# EAGLE design intex_spa_V4 (EAGLE 8.3.2)
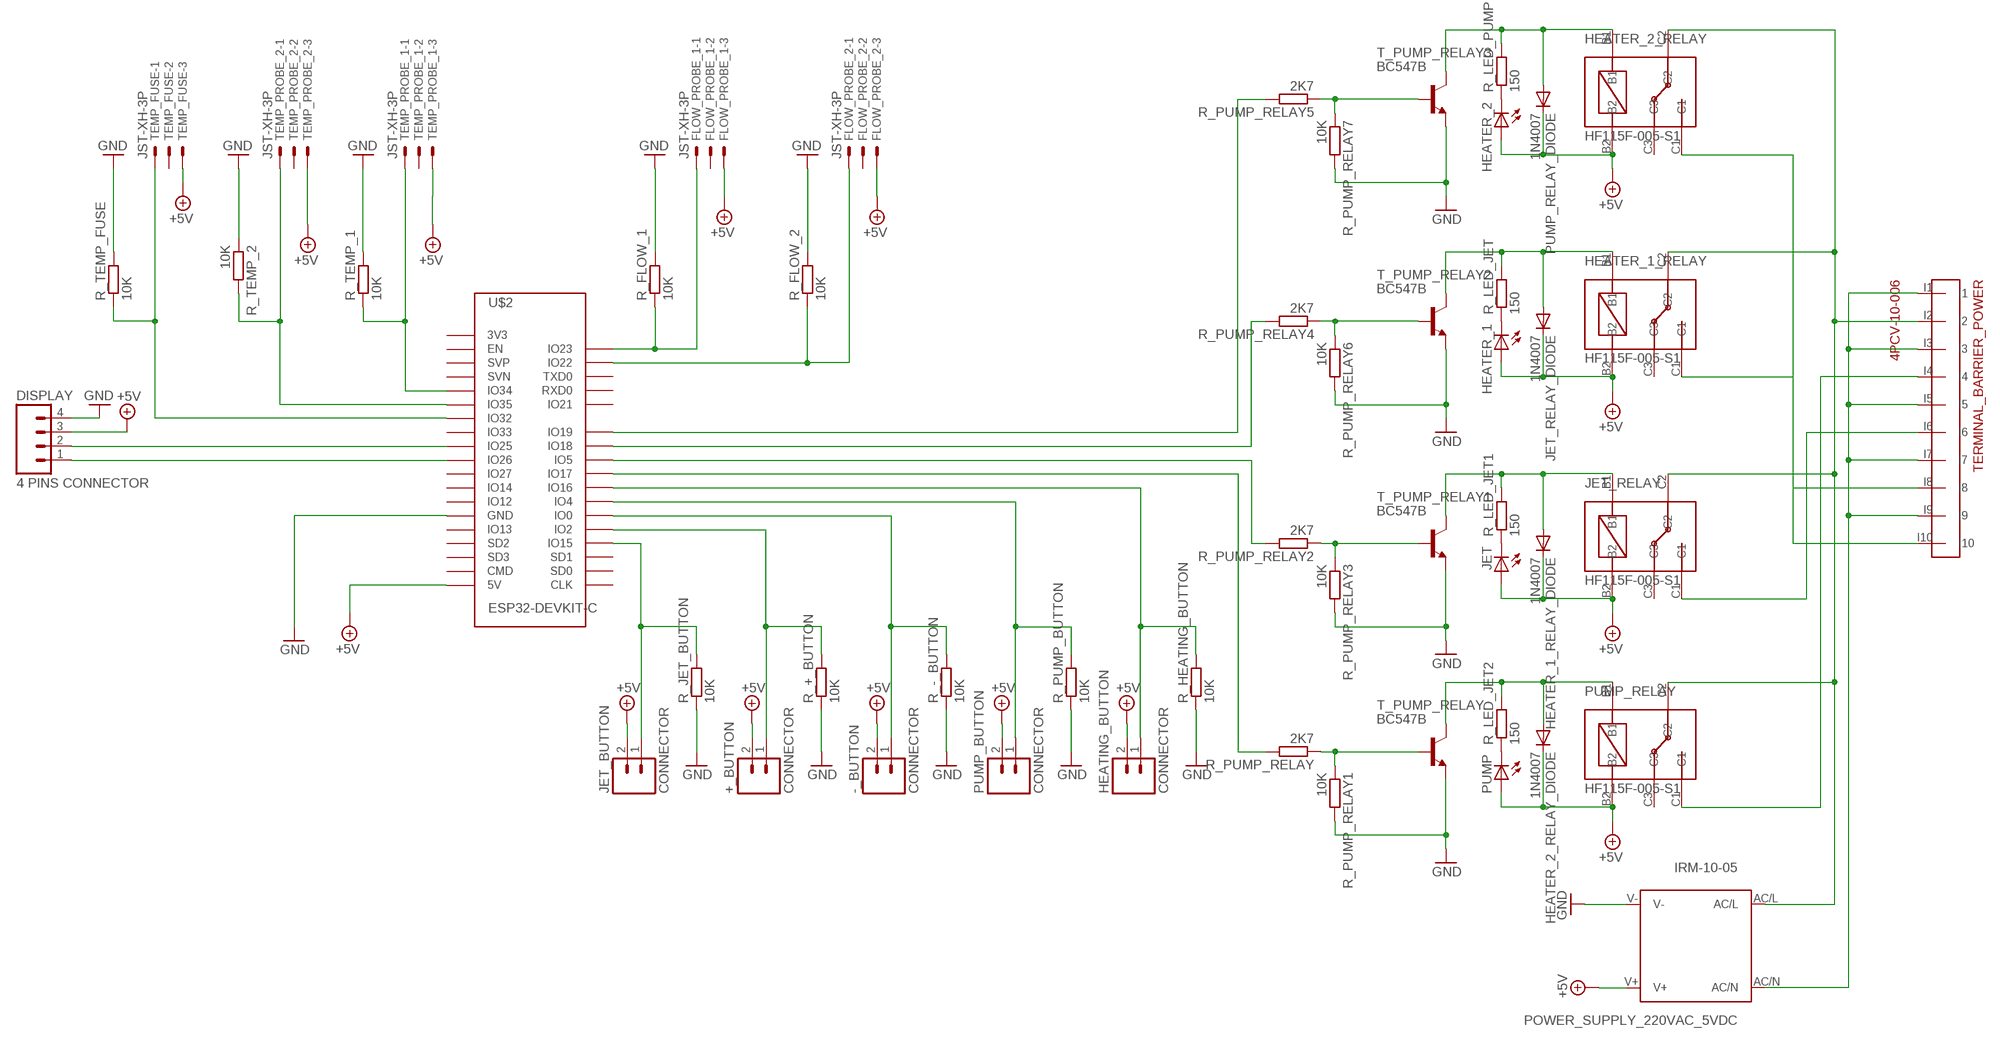
[diagram p0: schematic, sheet 1]

## Parts
+_BUTTON  CONNECTOR  M02JST-PTH-VERT  [JST-2-PTH-VERT]
-_BUTTON  CONNECTOR  M02JST-PTH-VERT  [JST-2-PTH-VERT]
DISPLAY  4 PINS CONNECTOR  M04PTH  [1X04]
FLOW_PROBE_1  JST-XH-3P  JST-XH-03-PIN-LONG-PAD  [JST-XH-03-PACKAGE-LONG-PAD]
FLOW_PROBE_2  JST-XH-3P  JST-XH-03-PIN-LONG-PAD  [JST-XH-03-PACKAGE-LONG-PAD]
HEATER_1  LED3MM  [LED3MM]
HEATER_1_RELAY  HF115F-005-S1  [HF115F-005-S1]
HEATER_1_RELAY_DIODE  1N4007  1N4004  [DO41-10]
HEATER_2  LED3MM  [LED3MM]
HEATER_2_RELAY  HF115F-005-S1  [HF115F-005-S1]
HEATER_2_RELAY_DIODE  1N4007  1N4004  [DO41-10]
HEATING_BUTTON  CONNECTOR  M02JST-PTH-VERT  [JST-2-PTH-VERT]
JET  LED3MM  [LED3MM]
JET_BUTTON  CONNECTOR  M02JST-PTH-VERT  [JST-2-PTH-VERT]
JET_RELAY  HF115F-005-S1  [HF115F-005-S1]
JET_RELAY_DIODE  1N4007  1N4004  [DO41-10]
POWER_SUPPLY_220VAC_5VDC  IRM-10-05  IRM_05/10IRM_05/10  [IRM_05/10]
PUMP  LED3MM  [LED3MM]
PUMP_BUTTON  CONNECTOR  M02JST-PTH-VERT  [JST-2-PTH-VERT]
PUMP_RELAY  HF115F-005-S1  [HF115F-005-S1]
PUMP_RELAY_DIODE  1N4007  1N4004  [DO41-10]
R_+_BUTTON  10K  R-EU_0204/5  [0204/5]
R_-_BUTTON  10K  R-EU_0204/5  [0204/5]
R_FLOW_1  10K  R-EU_0207/10  [0207/10]
R_FLOW_2  10K  R-EU_0207/10  [0207/10]
R_HEATING_BUTTON  10K  R-EU_0204/5  [0204/5]
R_JET_BUTTON  10K  R-EU_0204/5  [0204/5]
R_LED_JET  150  R-EU_0204/5  [0204/5]
R_LED_JET1  150  R-EU_0204/5  [0204/5]
R_LED_JET2  150  R-EU_0204/5  [0204/5]
R_LED_PUMP  150  R-EU_0204/5  [0204/5]
R_PUMP_BUTTON  10K  R-EU_0204/5  [0204/5]
R_PUMP_RELAY  2K7  R-EU_0204/5  [0204/5]
R_PUMP_RELAY1  10K  R-EU_0204/5  [0204/5]
R_PUMP_RELAY2  2K7  R-EU_0204/5  [0204/5]
R_PUMP_RELAY3  10K  R-EU_0204/5  [0204/5]
R_PUMP_RELAY4  2K7  R-EU_0204/5  [0204/5]
R_PUMP_RELAY5  2K7  R-EU_0204/5  [0204/5]
R_PUMP_RELAY6  10K  R-EU_0204/5  [0204/5]
R_PUMP_RELAY7  10K  R-EU_0204/5  [0204/5]
R_TEMP_1  10K  R-EU_0207/10  [0207/10]
R_TEMP_2  10K  R-EU_0207/10  [0207/10]
R_TEMP_FUSE  10K  R-EU_0207/10  [0207/10]
T_PUMP_RELAY  BC547B  [TO92]
T_PUMP_RELAY1  BC547B  [TO92]
T_PUMP_RELAY2  BC547B  [TO92]
T_PUMP_RELAY3  BC547B  [TO92]
TEMP_FUSE  JST-XH-3P  JST-XH-03-PIN-LONG-PAD  [JST-XH-03-PACKAGE-LONG-PAD]
TEMP_PROBE_1  JST-XH-3P  JST-XH-03-PIN-LONG-PAD  [JST-XH-03-PACKAGE-LONG-PAD]
TEMP_PROBE_2  JST-XH-3P  JST-XH-03-PIN-LONG-PAD  [JST-XH-03-PACKAGE-LONG-PAD]
TERMINAL_BARRIER_POWER  4PCV-10-006  [4PCV-10-006]
U$2  ESP32-DEVKIT-C  [ESP32-DEVKIT-C]

## Nets
+5V: +_BUTTON.2 -_BUTTON.2 DISPLAY.3 FLOW_PROBE_1.3 FLOW_PROBE_2.3 HEATER_1.A HEATER_1_RELAY.B2 HEATER_1_RELAY_DIODE.C HEATER_2.A HEATER_2_RELAY.B2 HEATER_2_RELAY_DIODE.C HEATING_BUTTON.2 JET.A JET_BUTTON.2 JET_RELAY.B2 JET_RELAY_DIODE.C POWER_SUPPLY_220VAC_5VDC.V+ PUMP.A PUMP_BUTTON.2 PUMP_RELAY.B2 PUMP_RELAY_DIODE.C TEMP_FUSE.3 TEMP_PROBE_1.3 TEMP_PROBE_2.3 U$2.5V
GND: DISPLAY.4 POWER_SUPPLY_220VAC_5VDC.V- R_+_BUTTON.1 R_-_BUTTON.1 R_FLOW_1.2 R_FLOW_2.2 R_HEATING_BUTTON.1 R_JET_BUTTON.1 R_PUMP_BUTTON.1 R_PUMP_RELAY1.2 R_PUMP_RELAY3.2 R_PUMP_RELAY6.2 R_PUMP_RELAY7.2 R_TEMP_1.2 R_TEMP_2.1 R_TEMP_FUSE.2 T_PUMP_RELAY1.1(E) T_PUMP_RELAY2.1(E) T_PUMP_RELAY3.1(E) T_PUMP_RELAY.1(E) U$2.GND U$2.GND2(GND) U$2.GND3(GND)
LEAD: HEATER_1_RELAY.C2 HEATER_2_RELAY.C2 JET_RELAY.C2 POWER_SUPPLY_220VAC_5VDC.AC/L PUMP_RELAY.C2 TERMINAL_BARRIER_POWER.I2
LEAD_HEATER_1: HEATER_1_RELAY.C1 TERMINAL_BARRIER_POWER.I8
LEAD_HEATER_2: HEATER_2_RELAY.C1 TERMINAL_BARRIER_POWER.I10
LEAD_JET: JET_RELAY.C1 TERMINAL_BARRIER_POWER.I6
LEAD_PUMP: PUMP_RELAY.C1 TERMINAL_BARRIER_POWER.I4
N$1: R_PUMP_RELAY.2 U$2.IO17
N$2: R_TEMP_2.2 TEMP_PROBE_2.1 U$2.IO35
N$4: FLOW_PROBE_2.1 R_FLOW_2.1 U$2.IO22
N$5: R_PUMP_RELAY5.2 U$2.IO19
N$6: R_PUMP_RELAY4.2 U$2.IO18
N$7: R_PUMP_RELAY2.2 U$2.IO5
N$8: HEATER_2.K(C) R_LED_PUMP.1
N$9: R_TEMP_FUSE.1 TEMP_FUSE.1 U$2.IO32
N$10: FLOW_PROBE_1.1 R_FLOW_1.1 U$2.IO23
N$12: DISPLAY.1 U$2.IO26
N$13: DISPLAY.2 U$2.IO25
N$14: HEATING_BUTTON.1 R_HEATING_BUTTON.2 U$2.IO16
N$15: -_BUTTON.1 R_-_BUTTON.2 U$2.IO0
N$16: PUMP_BUTTON.1 R_PUMP_BUTTON.2 U$2.IO4
N$18: +_BUTTON.1 R_+_BUTTON.2 U$2.IO2
N$19: JET_BUTTON.1 R_JET_BUTTON.2 U$2.IO15
N$20: JET.K(C) R_LED_JET1.1
N$21: HEATER_1_RELAY_DIODE.A JET_RELAY.B1 R_LED_JET1.2 T_PUMP_RELAY1.3(C)
N$22: HEATER_1.K(C) R_LED_JET.1
N$24: PUMP.K(C) R_LED_JET2.1
N$25: HEATER_2_RELAY_DIODE.A PUMP_RELAY.B1 R_LED_JET2.2 T_PUMP_RELAY.3(C)
N$31: R_TEMP_1.1 TEMP_PROBE_1.1 U$2.IO34
N$32: R_PUMP_RELAY1.1 R_PUMP_RELAY.1 T_PUMP_RELAY.2(B)
N$33: HEATER_1_RELAY.B1 JET_RELAY_DIODE.A R_LED_JET.2 T_PUMP_RELAY2.3(C)
N$34: HEATER_2_RELAY.B1 PUMP_RELAY_DIODE.A R_LED_PUMP.2 T_PUMP_RELAY3.3(C)
N$35: R_PUMP_RELAY2.1 R_PUMP_RELAY3.1 T_PUMP_RELAY1.2(B)
N$38: R_PUMP_RELAY4.1 R_PUMP_RELAY6.1 T_PUMP_RELAY2.2(B)
N$39: R_PUMP_RELAY5.1 R_PUMP_RELAY7.1 T_PUMP_RELAY3.2(B)
NEUTRAL: POWER_SUPPLY_220VAC_5VDC.AC/N TERMINAL_BARRIER_POWER.I1 TERMINAL_BARRIER_POWER.I3 TERMINAL_BARRIER_POWER.I5 TERMINAL_BARRIER_POWER.I7 TERMINAL_BARRIER_POWER.I9
Unconnected: FLOW_PROBE_1.2 FLOW_PROBE_2.2 HEATER_1_RELAY.C3 HEATER_2_RELAY.C3 JET_RELAY.C3 PUMP_RELAY.C3 TEMP_FUSE.2 TEMP_PROBE_1.2 TEMP_PROBE_2.2 U$2.3V3 U$2.CLK U$2.CMD U$2.EN U$2.IO12 U$2.IO13 U$2.IO14 U$2.IO21 U$2.IO27 U$2.IO33 U$2.RXD0 U$2.SD0 U$2.SD1 U$2.SD2 U$2.SD3 U$2.SVN U$2.SVP U$2.TXD0

## Library data of the parts
+_BUTTON -_BUTTON HEATING_BUTTON JET_BUTTON PUMP_BUTTON = SparkFun-Connectors:M02: Standard 2-pin 0.1" header. Use with - straight break away headers ( PRT-00116) - right angle break away headers (PRT-00553) - swiss pins (PRT-00743) - machine pins (PRT-00117) - female headers (PRT-00115) Molex polarized connector foot print use with: PRT-08233 with associated crimp pins and housings. 2.54_SCREWTERM for use with PRT-10571. 3.5mm Screw Terminal footprints for PRT-08084 5mm Screw Terminal footprints for use with PRT-08432
DISPLAY = SparkFun-Connectors:M04: Header 4 Standard 4-pin 0.1" header. Use with straight break away headers (SKU : PRT-00116), right angle break away headers (PRT-00553), swiss pins (PRT-00743), machine pins (PRT-00117), and female headers (PRT-00115). Molex polarized connector foot print use with SKU : PRT-08231 with associated crimp pins and housings. 1MM SMD Version SKU: PRT-10208; PROD_ID: CONN-09696
FLOW_PROBE_1 FLOW_PROBE_2 TEMP_FUSE TEMP_PROBE_1 TEMP_PROBE_2 = Rembrandt Electronics - JST XH Connectors v1-0:JST-XH-03-PIN: JST XH Connector 2 Pin Wire to board connector. Pitch: 2,54 mm, (0.100") Number of pins: 3 Created by Rembrandt Electronics www.rembrandtelectronics.com
HEATER_1 HEATER_2 JET PUMP = led:LED: LED OSRAM: - CHIPLED LG R971, LG N971, LY N971, LG Q971, LY Q971, LO R971, LY R971 LH N974, LH R974 LS Q976, LO Q976, LY Q976 LO Q996 - Hyper CHIPLED LW Q18S LB Q993, LB Q99A, LB R99A - SideLED LS A670, LO A670, LY A670, LG A670, LP A670 LB A673, LV A673, LT A673, LW A673 LH A674 LY A675 LS A676, LA A676, LO A676, LY A676, LW A676 LS A679, LY A679, LG A679 - Hyper Micro SIDELED® LS Y876, LA Y876, LO Y876, LY Y876 LT Y87S - SmartLED LW L88C, LW L88S LB L89C, LB L89S, LG L890 LS L89K, LO L89K, LY L89K LS L896, LA L896, LO L896, LY L896 - TOPLED LS T670, LO T670, LY T670, LG T670, LP T670 LSG T670, LSP T670, LSY T670, LOP T670, LYG T670 LG T671, LOG T671, LSG T671 LB T673, LV T673, LT T673, LW T673 LH T674 LS T676, LA T676, LO T676, LY T676, LB T676, LH T676, LSB T676, LW T676 LB T67C, LV T67C, LT T67C, LS T67K, LO T67K, LY T67K, LW E67C LS E67B, LA E67B, LO E67B, LY E67B, LB E67C, LV E67C, LT E67C LW T67C LS T679, LY T679, LG T679 LS T770, LO T770, LY T770, LG T770, LP T770 LB T773, LV T773, LT T773, LW T773 LH T774 LS E675, LA E675, LY E675, LS T675 LS T776, LA T776, LO T776, LY T776, LB T776 LHGB T686 LT T68C, LB T68C - Hyper Mini TOPLED® LB M676 - Mini TOPLED Santana® LG M470 LS M47K, LO M47K, LY M47K Source: http://www.osram.convergy.de LUXEON: - LUMILED® LXK2-PW12-R00, LXK2-PW12-S00, LXK2-PW14-U00, LXK2-PW14-V00 LXK2-PM12-R00, LXK2-PM12-S00, LXK2-PM14-U00 LXK2-PE12-Q00, LXK2-PE12-R00, LXK2-PE12-S00, LXK2-PE14-T00, LXK2-PE14-U00 LXK2-PB12-K00, LXK2-PB12-L00, LXK2-PB12-M00, LXK2-PB14-N00, LXK2-PB14-P00, LXK2-PB14-Q00 LXK2-PR12-L00, LXK2-PR12-M00, LXK2-PR14-Q00, LXK2-PR14-R00 LXK2-PD12-Q00, LXK2-PD12-R00, LXK2-PD12-S00 LXK2-PH12-R00, LXK2-PH12-S00 LXK2-PL12-P00, LXK2-PL12-Q00, LXK2-PL12-R00 Source: www.luxeon.com KINGBRIGHT: KA-3528ASYC Source: www.kingbright.com
HEATER_1_RELAY HEATER_2_RELAY JET_RELAY PUMP_RELAY = HF115F-005-S1:HF115F-005-S1
HEATER_1_RELAY_DIODE HEATER_2_RELAY_DIODE JET_RELAY_DIODE PUMP_RELAY_DIODE = diode:1N4004: DIODE general purpose rectifier, 1 A
POWER_SUPPLY_220VAC_5VDC = meanwell_irm_v7:IRM_05/10: 5 or 10 watt housing & pin compatible IRM 05 Vout [V] Imax [A] Pmax [W] Eff [%] 3.3 1.25 4.125 68 5 1 5 71 12 0.42 5.04 75 15 0.33 4.95 75 24 0.23 5.52 77 IRM 10 Vout [V] Imax [A] Pmax [W] Eff [%] 3.3 2.5 8.25 74 5 2 10 77 12 0.85 10.2 82 15 0.67 10.05 82 24 0.42 10.08 82
R_+_BUTTON R_-_BUTTON R_FLOW_1 R_FLOW_2 R_HEATING_BUTTON R_JET_BUTTON R_PUMP_BUTTON R_PUMP_RELAY R_PUMP_RELAY1-R_PUMP_RELAY7 R_TEMP_1 R_TEMP_2 R_TEMP_FUSE = rcl:R-EU_: RESISTOR, European symbol
R_LED_JET R_LED_JET1 R_LED_JET2 R_LED_PUMP = resistor:R-EU_: RESISTOR, European symbol
T_PUMP_RELAY T_PUMP_RELAY1-T_PUMP_RELAY3 = transistor-npn:BC547*: NPN Transistor
TERMINAL_BARRIER_POWER = 4PCV-10-006:4PCV-10-006
U$2 = ESP32:ESP32-DEVKIT-C: Espressif ESP32 DEVKIT C MODULE.

## Net classes
0 default: width 0.152 mm, drill 0.508 mm, clearance 0.1 mm
1 220V: width 2.362 mm, drill 0.508 mm, clearance 1.25 mm to class 0, clearance 1.25 mm

## Board
Intex Arduino Spa Manager MK 0 - Designed by Richard Perez richard@perez-mail.fr
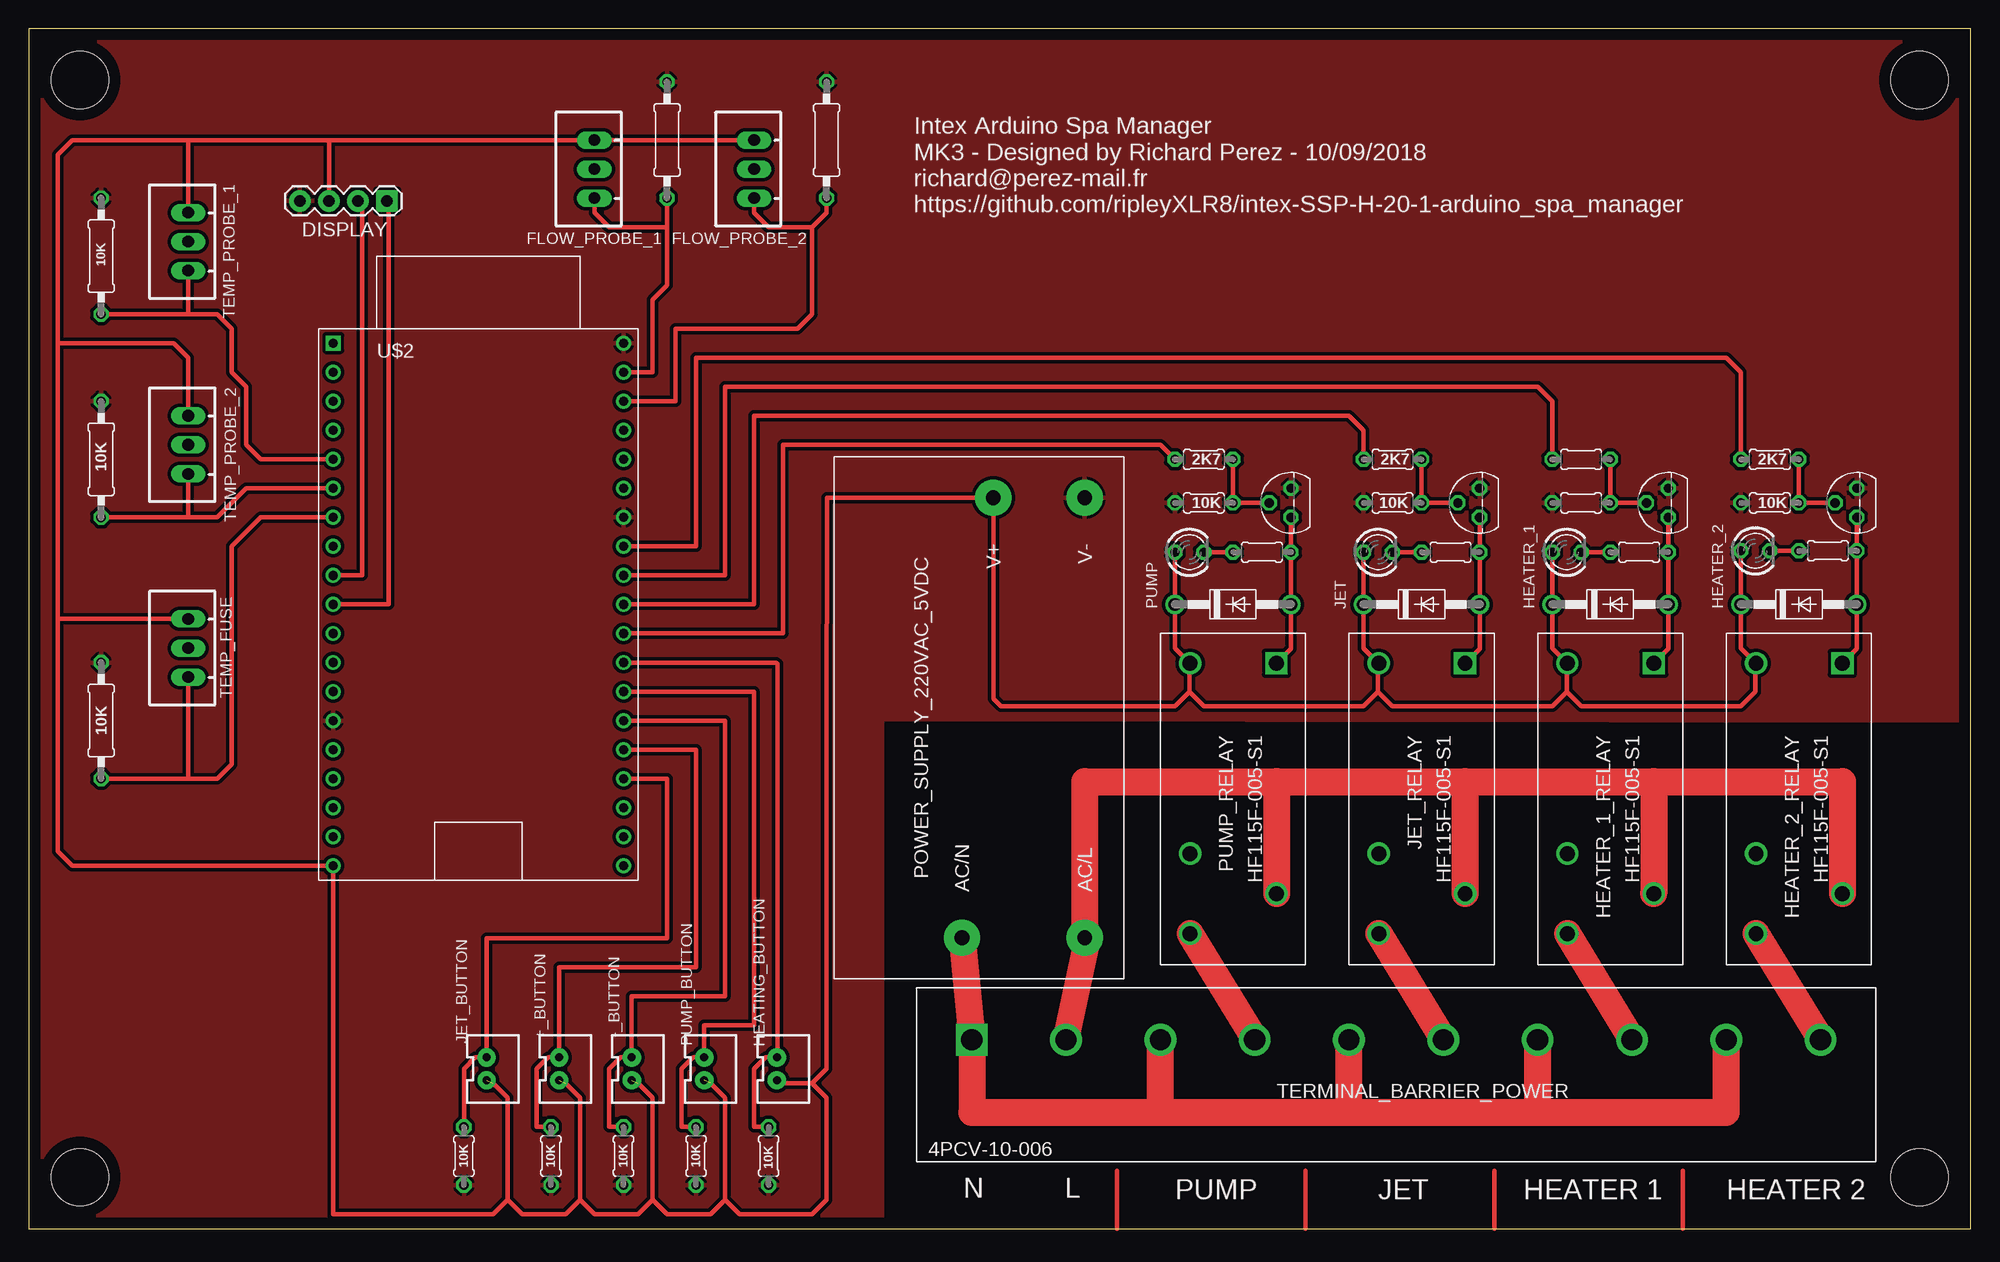
[diagram p1: board, top side]
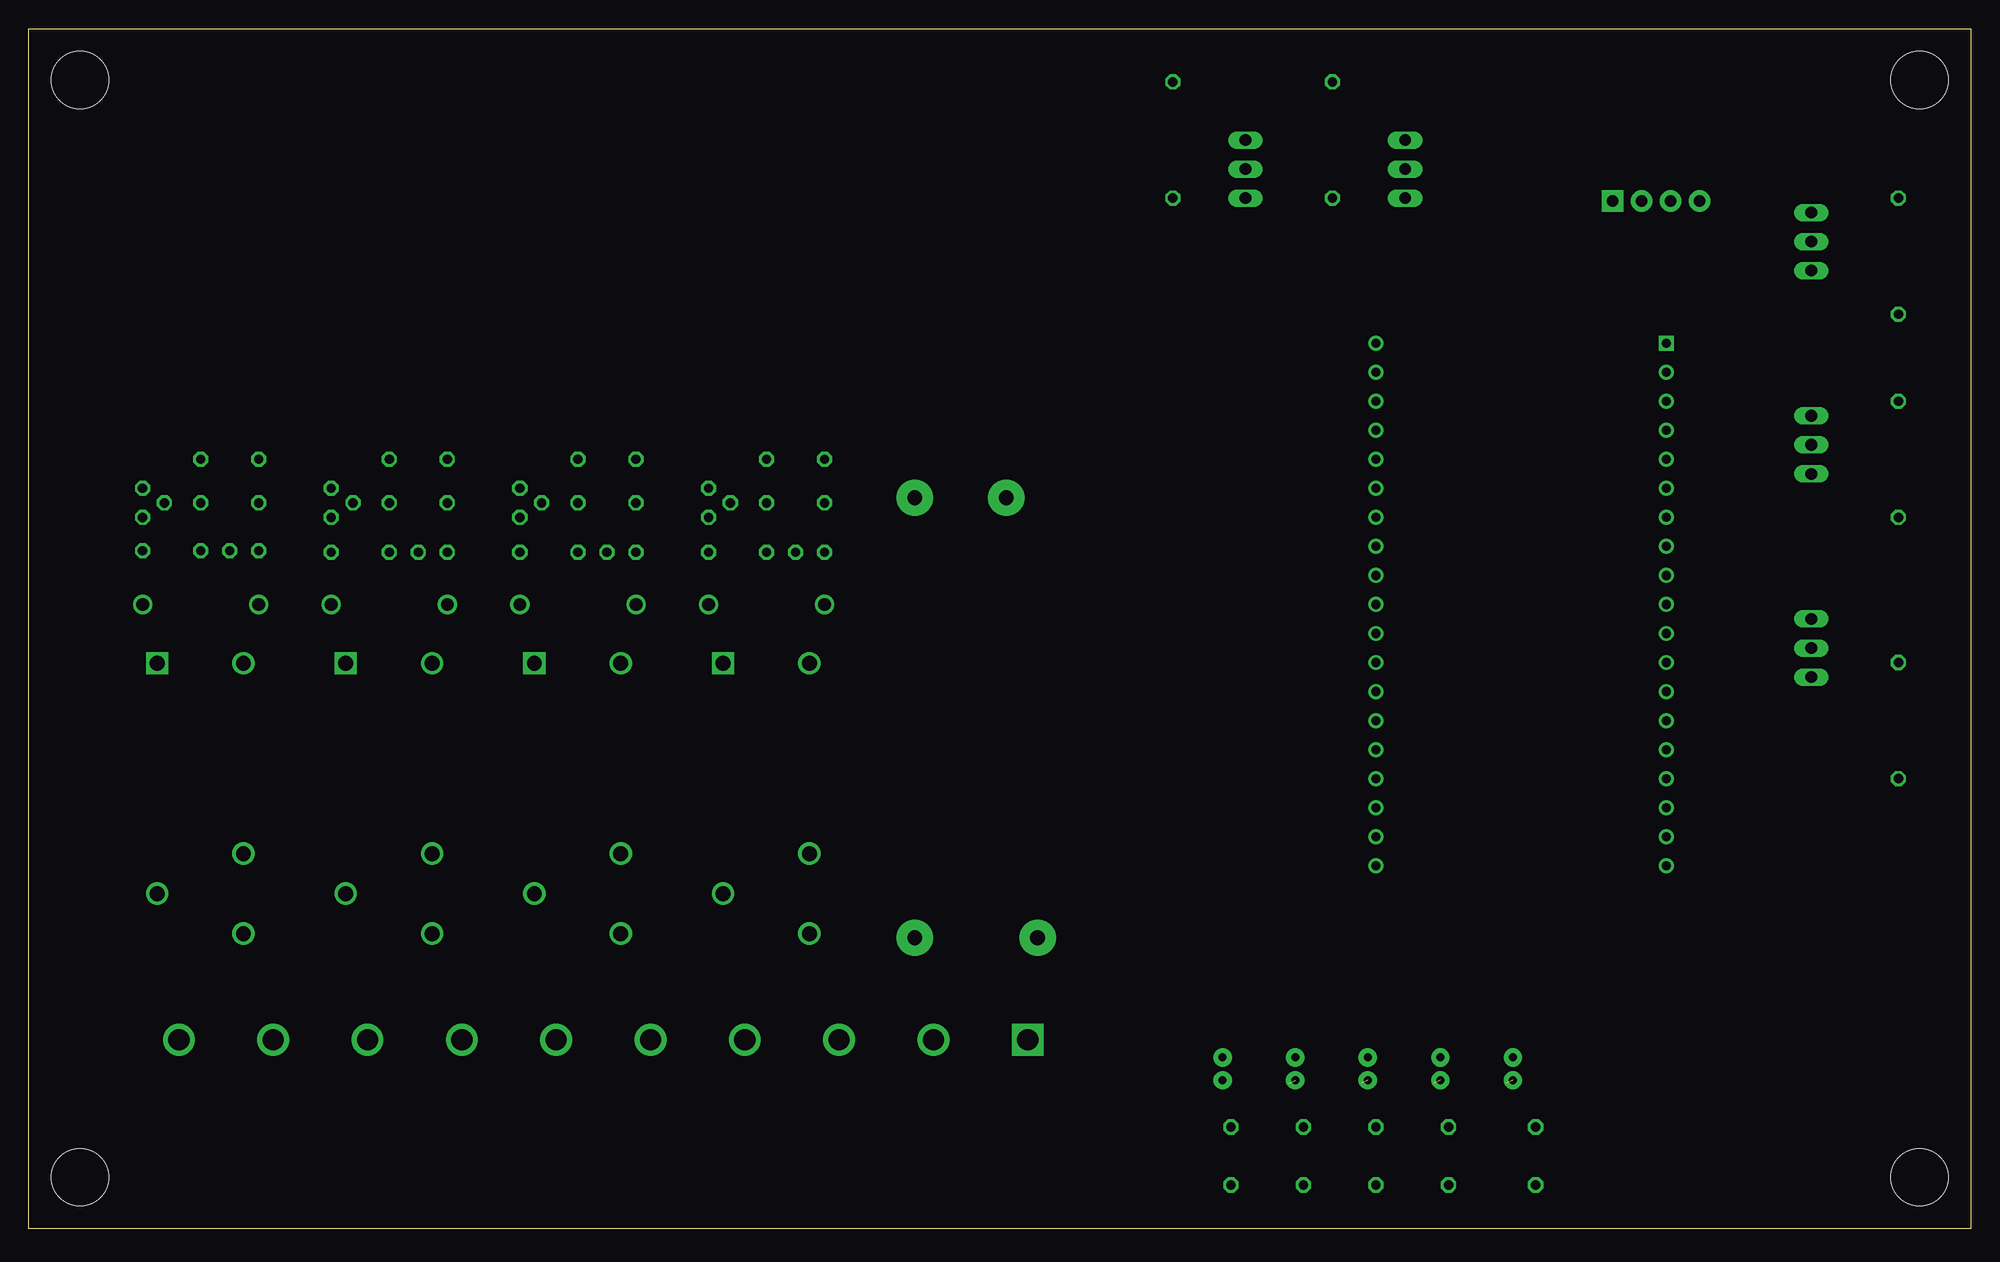
[diagram p2: board, bottom side, seen from below]

Size 170 x 105 mm. Coordinates in mm from the lower left corner, seen from the top.
Outline: 0,0 170,0 170,105 0,105 0,0
Copper layers (1*16): Top 0.07mm / dielectric 1.6mm / Bottom 0.035mm
Design rules "default *": minimum track width 1mil, minimum drill 0.35mm, track to track 6mil, track to pad 6mil, pad to pad 6mil, via to via 6mil, smd to smd 6mil, copper to edge 40mil, drill to drill 6mil, minimum pad ring 10mil, minimum via ring 8mil, stop-mask expansion 4mil, vias tented up to drill 0mil, thermal gap 10mil
Holes 5 mm at 4.5,4.5 4.5,100.5 165.5,100.5 165.5,4.5

### Footprints (pad centres in the part's own frame; a part is rotated, then mirrored left to right if it is on the bottom)
JST-2-PTH-VERT = drill 0.7 pad 1.6: 1 -1,-0.55; 2 1,-0.55
1X04 = drill 1.016 pad 1.88 square: 1 0,0 | drill 1.016 pad 1.88: 2 2.54,0; 3 5.08,0; 4 7.62,0
JST-XH-03-PACKAGE-LONG-PAD = drill 1.016 long: 1 -2.54,0; 2 0,0; 3 2.54,0
LED3MM = drill 0.813 octagon: A -1.27,0; K 1.27,0
HF115F-005-S1 = drill 1.3 square: B1 2.6,10.16 | drill 1.3: B2 2.6,2.6; C1 26.26,2.6; C2 22.76,10.16; C3 19.26,2.6
DO41-10 = drill 1.118: A 5.08,0; C -5.08,0
IRM_05/10 = drill 1.3 pad 3.17: AC/L -19.25,-9.25; AC/N -19.25,1.5; V+ 19.25,-1.25; V- 19.25,-9.25
0204/5 = drill 0.813 octagon: 1 -2.54,0; 2 2.54,0
0207/10 = drill 0.813 octagon: 1 -5.08,0; 2 5.08,0
TO92 = drill 0.813 octagon: 1 1.27,0; 2 0,1.905; 3 -1.27,0
4PCV-10-006 = drill 1.854 square: I1 -36.83,5.08 | drill 1.854: I2 -28.575,5.08; I3 -20.32,5.08; I4 -12.065,5.08; I5 -3.81,5.08; I6 4.445,5.08; I7 12.7,5.08; I8 20.955,5.08; I9 29.21,5.08; I10 37.465,5.08
ESP32-DEVKIT-C = drill 0.8 square: 3V3 -12.7,20.32 | drill 0.8: 5V -12.7,-25.4; CLK 12.7,-25.4; CMD -12.7,-22.86; EN -12.7,17.78; GND -12.7,-12.7; GND2 12.7,20.32; GND3 12.7,5.08; IO0 12.7,-12.7; IO2 12.7,-15.24; IO4 12.7,-10.16; IO5 12.7,-2.54; IO12 -12.7,-10.16; IO13 -12.7,-15.24; IO14 -12.7,-7.62; IO15 12.7,-17.78; IO16 12.7,-7.62; IO17 12.7,-5.08; IO18 12.7,0; IO19 12.7,2.54; IO21 12.7,7.62; IO22 12.7,15.24; IO23 12.7,17.78; IO25 -12.7,0; IO26 -12.7,-2.54; IO27 -12.7,-5.08; IO32 -12.7,5.08; IO33 -12.7,2.54; IO34 -12.7,10.16; IO35 -12.7,7.62; RXD0 12.7,10.16; SD0 12.7,-22.86; SD1 12.7,-20.32; SD2 -12.7,-17.78; SD3 -12.7,-20.32; SVN -12.7,12.7; SVP -12.7,15.24; TXD0 12.7,12.7

### Placement (x,y rotation side)
+_BUTTON  46.99,13.97 270 top
-_BUTTON  53.34,13.97 270 top
DISPLAY  31.37,89.92 180 top
FLOW_PROBE_1  49.53,92.71 90 top
FLOW_PROBE_2  63.5,92.71 90 top
HEATER_1  134.62,59.18 0 top
HEATER_1_RELAY  132.08,52.07 270 top
HEATER_1_RELAY_DIODE  121.92,54.61 0 top
HEATER_2  151.13,59.31 0 top
HEATER_2_RELAY  148.59,52.07 270 top
HEATER_2_RELAY_DIODE  105.41,54.61 0 top
HEATING_BUTTON  66.04,13.97 270 top
JET  118.11,59.18 0 top
JET_BUTTON  40.64,13.97 270 top
JET_RELAY  115.57,52.07 270 top
JET_RELAY_DIODE  138.43,54.61 0 top
POWER_SUPPLY_220VAC_5VDC  83.19,44.7 90 top
PUMP  101.6,59.18 0 top
PUMP_BUTTON  59.69,13.97 270 top
PUMP_RELAY  99.06,52.07 270 top
PUMP_RELAY_DIODE  154.94,54.61 0 top
R_+_BUTTON  45.72,6.35 90 top
R_-_BUTTON  52.07,6.35 90 top
R_FLOW_1  55.88,95.25 90 top
R_FLOW_2  69.85,95.25 90 top
R_HEATING_BUTTON  64.77,6.35 90 top
R_JET_BUTTON  38.1,6.35 90 top
R_LED_JET  140.97,59.18 0 top
R_LED_JET1  124.46,59.18 0 top
R_LED_JET2  107.95,59.18 0 top
R_LED_PUMP  157.48,59.31 0 top
R_PUMP_BUTTON  58.42,6.35 90 top
R_PUMP_RELAY  102.87,67.31 180 top
R_PUMP_RELAY1  102.87,63.5 180 top
R_PUMP_RELAY2  119.38,67.31 180 top
R_PUMP_RELAY3  119.38,63.5 180 top
R_PUMP_RELAY4  135.89,67.31 180 top
R_PUMP_RELAY5  152.4,67.31 180 top
R_PUMP_RELAY6  135.89,63.5 180 top
R_PUMP_RELAY7  152.4,63.5 180 top
R_TEMP_1  6.35,85.09 90 top
R_TEMP_2  6.35,67.31 270 top
R_TEMP_FUSE  6.35,44.45 90 top
T_PUMP_RELAY  110.49,63.5 90 top
T_PUMP_RELAY1  127,63.5 90 top
T_PUMP_RELAY2  143.51,63.5 90 top
T_PUMP_RELAY3  160.02,63.5 90 top
TEMP_FUSE  13.97,50.8 90 top
TEMP_PROBE_1  13.97,86.36 90 top
TEMP_PROBE_2  13.97,68.58 90 top
TERMINAL_BARRIER_POWER  119.38,11.43 0 top
U$2  39.37,57.15 0 top

### Tracks (layer width: path | path; a pad name or v marks a point on that pad's centre or on a via)
+5V  (4 unrouted)
  Top 0.406: 118.11,46.99 116.84,45.72 102.87,45.72 101.6,46.99 | 118.11,46.99 118.11,49.41 JET_RELAY.B2 116.84,50.8 HEATER_1_RELAY_DIODE.C JET.A | 118.11,46.99 119.38,45.72 133.35,45.72 134.62,46.99 | 134.62,46.99 134.62,49.41 HEATER_1_RELAY.B2 133.35,50.8 JET_RELAY_DIODE.C HEATER_1.A | 134.62,46.99 135.89,45.72 149.86,45.72 151.13,46.99 151.13,49.41 HEATER_2_RELAY.B2 149.86,50.8 PUMP_RELAY_DIODE.C HEATER_2.A | 68.58,12.7 69.85,13.97 69.85,41.91 69.87,63.95 POWER_SUPPLY_220VAC_5VDC.V+ 84.44,46.38 85.09,45.72 100.33,45.72 101.6,46.99 | 68.58,12.7 65.76,12.7 HEATING_BUTTON.2 | 68.58,12.7 69.85,11.43 69.85,2.54 68.58,1.27 62.23,1.27 60.96,2.54 | 60.96,2.54 60.96,11.43 59.69,12.7 | 60.96,2.54 59.69,1.27 55.88,1.27 54.61,2.54 | 54.61,2.54 54.61,11.43 53.34,12.7 | 54.61,2.54 53.34,1.27 49.53,1.27 48.26,2.54 | 48.26,2.54 48.26,11.43 46.99,12.7 | 48.26,2.54 46.99,1.27 43.18,1.27 41.91,2.54 | 41.91,2.54 41.91,11.43 40.64,12.7 | 41.91,2.54 40.64,1.27 26.67,1.27 U$2.5V 3.81,31.75 2.54,33.02 2.54,53.34 | 101.6,46.99 101.6,49.41 PUMP_RELAY.B2 100.33,50.8 HEATER_2_RELAY_DIODE.C PUMP.A | FLOW_PROBE_2.3 FLOW_PROBE_1.3 38.1,95.25 33.02,95.25 26.29,95.25 | 13.97,95.25 TEMP_PROBE_1.3 | 26.29,95.25 13.97,95.25 | DISPLAY.3 26.29,95.25 | 2.54,53.34 2.54,77.47 | 2.54,77.47 2.54,78.74 2.54,93.98 3.81,95.25 13.97,95.25 | 2.54,53.34 2.54,52.07 | TEMP_FUSE.3 2.54,53.34 | 2.54,77.47 12.7,77.47 13.97,76.2 TEMP_PROBE_2.3
GND
  pour Top (isolate 0.305): 0,105.41 170.18,105.41 170.18,44.45 74.68,44.58 74.68,-1.14 0,0
LEAD  (via drill 0.6)
  Top 2.362: TERMINAL_BARRIER_POWER.I2 v92.71,25.45 | POWER_SUPPLY_220VAC_5VDC.AC/L 92.46,25.45 92.46,39.12 109.22,39.12 | 109.22,39.12 PUMP_RELAY.C2 | 109.22,39.12 125.73,39.12 | 125.73,39.12 JET_RELAY.C2 | 125.73,39.12 142.24,39.12 | 142.24,39.12 HEATER_1_RELAY.C2 | 142.24,39.12 158.75,39.12 HEATER_2_RELAY.C2
  Bottom 2.362: POWER_SUPPLY_220VAC_5VDC.AC/L v92.71,25.45
LEAD_HEATER_1
  Top 2.362: HEATER_1_RELAY.C1 TERMINAL_BARRIER_POWER.I8
LEAD_HEATER_2
  Top 2.362: HEATER_2_RELAY.C1 TERMINAL_BARRIER_POWER.I10
LEAD_JET
  Top 2.362: JET_RELAY.C1 TERMINAL_BARRIER_POWER.I6
LEAD_PUMP
  Top 2.362: PUMP_RELAY.C1 TERMINAL_BARRIER_POWER.I4
N$1
  Top 0.406: R_PUMP_RELAY.2 99.06,68.58 66.04,68.58 66.04,52.07 U$2.IO17
N$2
  Top 0.406: 13.97,62.23 R_TEMP_2.2 | 13.97,62.23 16.51,62.23 17.78,63.5 19.05,64.77 U$2.IO35 | TEMP_PROBE_2.1 13.97,62.23
N$3
  Top 0.406: 95.25,0 95.25,5.08
N$4
  Top 0.406: R_FLOW_2.1 69.85,88.9 68.58,87.63 | 68.58,87.63 68.58,80.01 67.31,78.74 56.64,78.74 56.64,72.39 U$2.IO22 | FLOW_PROBE_2.1 63.5,88.9 64.77,87.63 68.58,87.63
N$5
  Top 0.406: R_PUMP_RELAY5.2 149.86,74.93 148.59,76.2 58.42,76.2 58.42,59.69 U$2.IO19
N$6
  Top 0.406: R_PUMP_RELAY4.2 133.35,72.39 132.08,73.66 60.96,73.66 60.96,57.15 U$2.IO18
N$7
  Top 0.406: R_PUMP_RELAY2.2 116.84,69.85 115.57,71.12 63.5,71.12 63.5,54.61 U$2.IO5
N$8
  Top 0.406: R_LED_PUMP.1 HEATER_2.K
N$9
  Top 0.406: TEMP_FUSE.1 13.97,44.45 13.97,39.37 | U$2.IO32 20.32,62.23 17.78,59.69 17.78,45.72 17.78,40.64 16.51,39.37 13.97,39.37 | 13.97,39.37 R_TEMP_FUSE.1
N$10
  Top 0.406: 55.88,87.63 R_FLOW_1.1 | FLOW_PROBE_1.1 49.53,88.9 50.8,87.63 55.88,87.63 | 55.88,87.63 55.88,82.55 54.61,81.28 54.61,74.93 U$2.IO23
N$12
  Top 0.406: DISPLAY.1 31.5,89.92 31.5,54.61 U$2.IO26
N$13
  Top 0.406: DISPLAY.2 29.21,89.92 29.21,57.15 U$2.IO25
N$14
  Top 0.406: R_HEATING_BUTTON.2 63.5,8.89 63.5,13.97 64.5,14.97 HEATING_BUTTON.1 65.53,14.97 65.53,49.4 65.41,49.53 U$2.IO16
N$15
  Top 0.406: -_BUTTON.1 51.8,14.97 50.8,13.97 50.8,8.89 R_-_BUTTON.2 | -_BUTTON.1 53.07,14.97 | U$2.IO0 60.96,44.45 60.96,20.32 52.79,20.32 -_BUTTON.1
N$16
  Top 0.406: PUMP_BUTTON.1 58.15,14.97 57.15,13.97 57.15,8.89 R_PUMP_BUTTON.2 | PUMP_BUTTON.1 59.18,14.97 | U$2.IO4 63.5,46.99 63.5,17.78 59.14,17.78 PUMP_BUTTON.1
N$18
  Top 0.406: R_+_BUTTON.2 44.45,8.89 44.45,13.97 45.45,14.97 +_BUTTON.1 46.44,22.86 58.42,22.86 58.42,41.91 U$2.IO2
N$19
  Top 0.406: JET_BUTTON.1 39.1,14.97 38.1,13.97 R_JET_BUTTON.2 | 40.13,15.01 JET_BUTTON.1 | U$2.IO15 55.88,39.37 55.88,25.4 40.09,25.4 JET_BUTTON.1
N$20
  Top 0.406: R_LED_JET1.1 JET.K
N$21
  Top 0.406: JET_RELAY.B1 127,50.74 HEATER_1_RELAY_DIODE.A R_LED_JET1.2 T_PUMP_RELAY1.3
N$22
  Top 0.406: R_LED_JET.1 HEATER_1.K
N$23
  Top 0.406: 111.76,0 111.76,5.08
N$24
  Top 0.406: R_LED_JET2.1 PUMP.K
N$25
  Top 0.406: PUMP_RELAY.B1 110.49,50.74 HEATER_2_RELAY_DIODE.A R_LED_JET2.2 T_PUMP_RELAY.3
N$26
  Top 0.406: 128.27,0 128.27,5.08
N$27
  Top 0.406: 144.78,0 144.78,5.08
N$31
  Top 0.406: 13.97,80.01 R_TEMP_1.1 | 13.97,80.01 16.51,80.01 17.78,78.74 17.78,74.93 19.05,73.66 19.05,68.58 20.32,67.31 U$2.IO34 | TEMP_PROBE_1.1 13.97,80.01
N$32
  Top 0.406: T_PUMP_RELAY.2 R_PUMP_RELAY1.1 R_PUMP_RELAY.1
N$33
  Top 0.406: HEATER_1_RELAY.B1 143.51,50.74 JET_RELAY_DIODE.A R_LED_JET.2 T_PUMP_RELAY2.3
N$34
  Top 0.406: HEATER_2_RELAY.B1 160.02,50.74 PUMP_RELAY_DIODE.A R_LED_PUMP.2 T_PUMP_RELAY3.3
N$35
  Top 0.406: T_PUMP_RELAY1.2 R_PUMP_RELAY3.1 R_PUMP_RELAY2.1
N$38
  Top 0.406: T_PUMP_RELAY2.2 R_PUMP_RELAY6.1 R_PUMP_RELAY4.1
N$39
  Top 0.406: T_PUMP_RELAY3.2 R_PUMP_RELAY7.1 R_PUMP_RELAY5.1
NEUTRAL
  Top 2.362: POWER_SUPPLY_220VAC_5VDC.AC/N TERMINAL_BARRIER_POWER.I1 82.55,10.16 99.06,10.16 | 99.06,10.16 TERMINAL_BARRIER_POWER.I3 | 99.06,10.16 115.57,10.16 | 115.57,10.16 TERMINAL_BARRIER_POWER.I5 | 115.57,10.16 132.08,10.16 | 132.08,10.16 TERMINAL_BARRIER_POWER.I7 | 132.08,10.16 148.59,10.16 TERMINAL_BARRIER_POWER.I9
  Bottom 2.362: POWER_SUPPLY_220VAC_5VDC.AC/N 81.28,25.45

### Text on the board
tNames: Intex Arduino Spa Manager / MK3 - Designed by Richard Perez - 10/09/2018 / richard@perez-mail.fr / https://github.com/ripleyXLR8/intex-SSP-H-20-1-arduino_spa_manager | N | L | PUMP | JET | HEATER 1 | HEATER 2